# Altium schematic sheet 14_FTDI.SchDoc
size A4
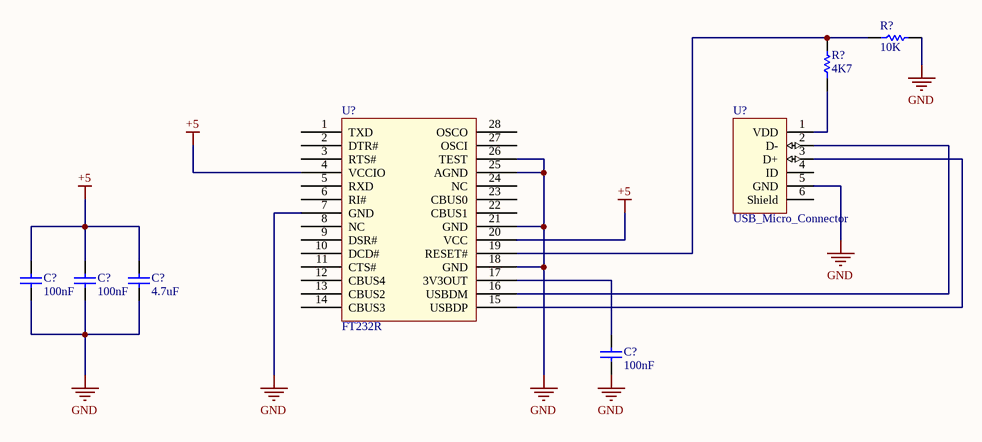
[diagram p0: 14_FTDI.SchDoc]

## Parts
(Parts that share a designator on the sheet are numbered #1, #2 ... from top to bottom, then left to right.)
C?#1  100nF  [CAP0402R]
C?#2  100nF  [CAP0402R]
C?#3  4.7uF  [CAP0402R]
C?#4  100nF  [CAP0402R]
R?#1  4K7  [RES0402R]
R?#2  10K  [RES0402R]
U?#1  USB_Micro_Connector  [USB_micro_through]
U?#2  FT232R

## Nets
+5: C?#1.1 C?#2.1 C?#3.1 U?#2.4(VCCIO) U?#2.20(VCC)
GND: C?#1.2 C?#2.2 C?#3.2 C?#4.2 R?#2.2 U?#1.5(GND) U?#2.7(GND) U?#2.18(GND) U?#2.21(GND) U?#2.25(AGND) U?#2.26(TEST)
NetC?#4_1: C?#4.1 U?#2.17(3V3OUT)
NetR?#1_1: R?#1.1 U?#1.1(VDD)
NetR?#1_2: R?#1.2 R?#2.1 U?#2.19(RESET#)
NetU?#1_2: U?#1.2(D-) U?#2.16(USBDM)
NetU?#1_3: U?#1.3(D+) U?#2.15(USBDP)

Not connected (* = marked no-connect by the designer): U?#1 4(ID) 6(Shield); U?#2 1(TXD) 2(DTR#) 3(RTS#) 5(RXD) 6(RI#) 8(NC) 9(DSR#) 10(DCD#) 11(CTS#) 12(CBUS4) 13(CBUS2) 14(CBUS3) 22(CBUS1) 23(CBUS0) 24(NC) 27(OSCI) 28(OSCO)

## Library data of the parts
C?#1-C?#4 = C: Capacitor; Class I: Passive; Revision: July-2002: Re-released for DXP Platform.; Supplier 1: *; Supplier Part Number 1: *
  C?#1 C?#2 C?#4: Value: 100nF
  C?#3: Value: 4.7uF
R?#1 R?#2 = R: Resistor; Supplier 1: *; Supplier Part Number 1: *
  R?#1: Value: 4K7
  R?#2: Value: 10K
U?#1 = USB_micro: CONN USB MICRO B RECPT SMT R/A; Manufacturer Part Number: 10118194-0001LF; 01 Created By: David Lynch @ 30/11/2017; 02 Reviewed By: Rodrigo Maureira @ 14/01/2018; Supplier Part Number 1: 609-4618-1-ND; Digikey URL: https://www.digikey.com.au/product-detail/en/amphenol-fci/10118194-0001LF/609-4618-1-ND/2785382; Supplier 1: Digi-Key
U?#2 = FT232R: 768-1306-ND